# Altium schematic sheet Ruido.SchDoc
size A4
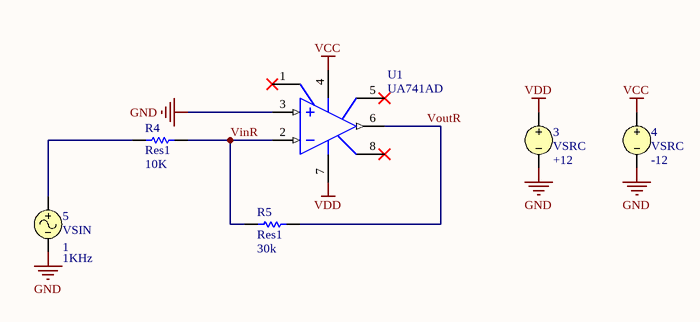
[diagram p0: Ruido.SchDoc]

## Parts
3  VSRC  value +12
4  VSRC  value -12
5  VSIN  Amplitude: 1  Frequency: 1KHz
R4  Res1  value 10K  [AXIAL-0.3]
R5  Res1  value 30k  [AXIAL-0.3]
U1  UA741AD  [SO8_L]

## Nets
GND: 3.2 4.2 5.2 U1.3(IN+)
VCC: 4.1 U1.4(V-)
VDD: 3.1 U1.7(V+)
VinR: R4.2 R5.1 U1.2(IN-)
VoutR: R5.2 U1.6(OUT)
Net5_1: 5.1 R4.1

Not connected (* = marked no-connect by the designer): U1 1(OS_NULL)* 5(OS_NULL)* 8(NC)*

## Library data of the parts
3 4 = VSRC: Voltage Source; Note: PCB Footprint - Not required; Published: 8-Jun-2000; LatestRevisionDate: 17-Jul-2002; LatestRevisionNote: Re-released for DXP Platform.; PackageReference: Not Applicable; Publisher: Altium Limited
5 = VSIN: Sinusoidal Voltage Source; Note: PCB Footprint - Not required; Published: 8-Jun-2000; LatestRevisionDate: 15-Nov-2004; LatestRevisionNote: Corrected Netlist.; PackageReference: Not Applicable; Publisher: Altium Limited
R4 R5 = Res1: Resistor; Published: 8-Jun-2000; LatestRevisionDate: 17-Jul-2002; LatestRevisionNote: Re-released for DXP Platform.; PackageReference: AXIAL-0.3; Publisher: Altium Limited; PackageDescription: Axial Device, Thru-Hole; 2 Leads; 0.3 in Pin Spacing
U1 = UA741AD: General-Purpose Single Operational Amplifier; Published: 24-Aug-2001; LatestRevisionDate: 13-Apr-2006; LatestRevisionNote: IPC-7351 Footprint Added.; DatasheetVersion: Oct-1997; PackageVersion: Dec-2002; PackageReference: SO8; Publisher: Altium Limited; PackageDescription: 8-Pin Small Outline Integrated Circuit 1.27 mm Pitch; Code_JEDEC: MS-012-AA; Code_IPC: SOIC127P600-8; ComponentLink1Description: Manufacturer Link; ComponentLink1URL: http://www.st.com/; ComponentLink2Description: Datasheet; ComponentLink2URL: http://www.st.com/stonline/products/literature/ds/5304/ua741.pdf